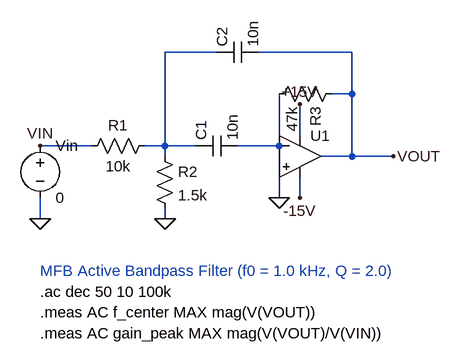
[diagram p0: schematic bandpass_filter.asc]
bandpass_filter.asc, the LTspice schematic file:
Version 4
SHEET 1 1100 700
WIRE 448 256 448 304
WIRE 480 208 480 160
WIRE 480 272 480 304
WIRE 80 224 160 224
WIRE 80 304 80 336
WIRE 240 224 272 224
WIRE 272 224 272 240
WIRE 272 320 272 336
WIRE 272 224 320 224
WIRE 384 224 448 224
WIRE 272 224 272 80
WIRE 272 80 352 80
WIRE 416 80 560 80
WIRE 560 80 560 240
WIRE 448 224 448 144
WIRE 528 144 560 144
WIRE 560 144 560 240
WIRE 512 240 560 240
WIRE 560 240 624 240
FLAG 448 304 0
FLAG 480 160 +15V
FLAG 480 304 -15V
FLAG 80 224 VIN
FLAG 80 336 0
FLAG 272 336 0
FLAG 624 240 VOUT
SYMBOL OpAmps\UniversalOpAmp2 480 240 R0
SYMATTR InstName U1
SYMBOL voltage 80 208 R0
SYMATTR InstName Vin
SYMATTR Value 0
SYMATTR Value2 AC 1
SYMBOL res 256 208 R90
WINDOW 0 0 56 VBottom 2
WINDOW 3 32 56 VTop 2
SYMATTR InstName R1
SYMATTR Value 10k
SYMBOL res 256 224 R0
SYMATTR InstName R2
SYMATTR Value 1.5k
SYMBOL cap 320 240 R270
SYMATTR InstName C1
SYMATTR Value 10n
SYMBOL cap 352 96 R270
SYMATTR InstName C2
SYMATTR Value 10n
SYMBOL res 544 128 R90
SYMATTR InstName R3
SYMATTR Value 47k
TEXT 80 416 Left 2 ;MFB Active Bandpass Filter (f0 = 1.0 kHz, Q = 2.0)
TEXT 80 448 Left 2 !.ac dec 50 10 100k
TEXT 80 480 Left 2 !.meas AC f_center MAX mag(V(VOUT))
TEXT 80 512 Left 2 !.meas AC gain_peak MAX mag(V(VOUT)/V(VIN))

The netlist it stands for:
* bandpass_filter.asc
XU1 0 N002 +15V -15V VOUT level2 Avol=1Meg GBW=10Meg Slew=10Meg Ilimit=25m Rail=0 Vos=0 En=0 Enk=0 In=0 Ink=0 Rin=500Meg  ; pins In+ In- V+ V- OUT
Vin VIN 0 0 AC 1
R1 N001 VIN 10k
R2 N001 0 1.5k
C1 N001 N002 10n
C2 N001 VOUT 10n
R3 VOUT N002 47k
* MFB Active Bandpass Filter (f0 = 1.0 kHz, Q = 2.0)
.ac dec 50 10 100k
.meas AC f_center MAX mag(V(VOUT))
.meas AC gain_peak MAX mag(V(VOUT)/V(VIN))
.lib UniversalOpAmp2.lib
.backanno
.end